# Altium schematic sheet JTAG.SchDoc: OnBoard Debugger
size A4; ApprovedBy: Diogo Gomes; CheckedBy: Bruno, Candido, Pedro; Author: João Vieira; CompanyName: LART; DrawnBy: João Vieira; Organization: LART; Address1: Morro do Lena; Address2: Alto Do Vieiro; Address3: APT 4163, Building D; DocumentNumber: 1; Revision: v1.4.2; SheetNumber: 2; SheetTotal: 12; ENG_APP_DATE: --/--/--; DSN_APP_DATE: --/--/--; CHK_APP_DATE: --/--/--; ProjectTitle: Autonomous Control Unit; Summary: The Debugger Interface as a alternative to using an offboard programmer; CheckedBy1: G. Candido; CheckedBy2: F. Chen; CheckedBy3: P. Ferreira; CheckedBy4: B. Vicente; CheckedBy5: _; CheckedBy6: _; CheckedBy7: _; version_tag: 1.4.2; ImagePath: C:\Users\micron\Desktop
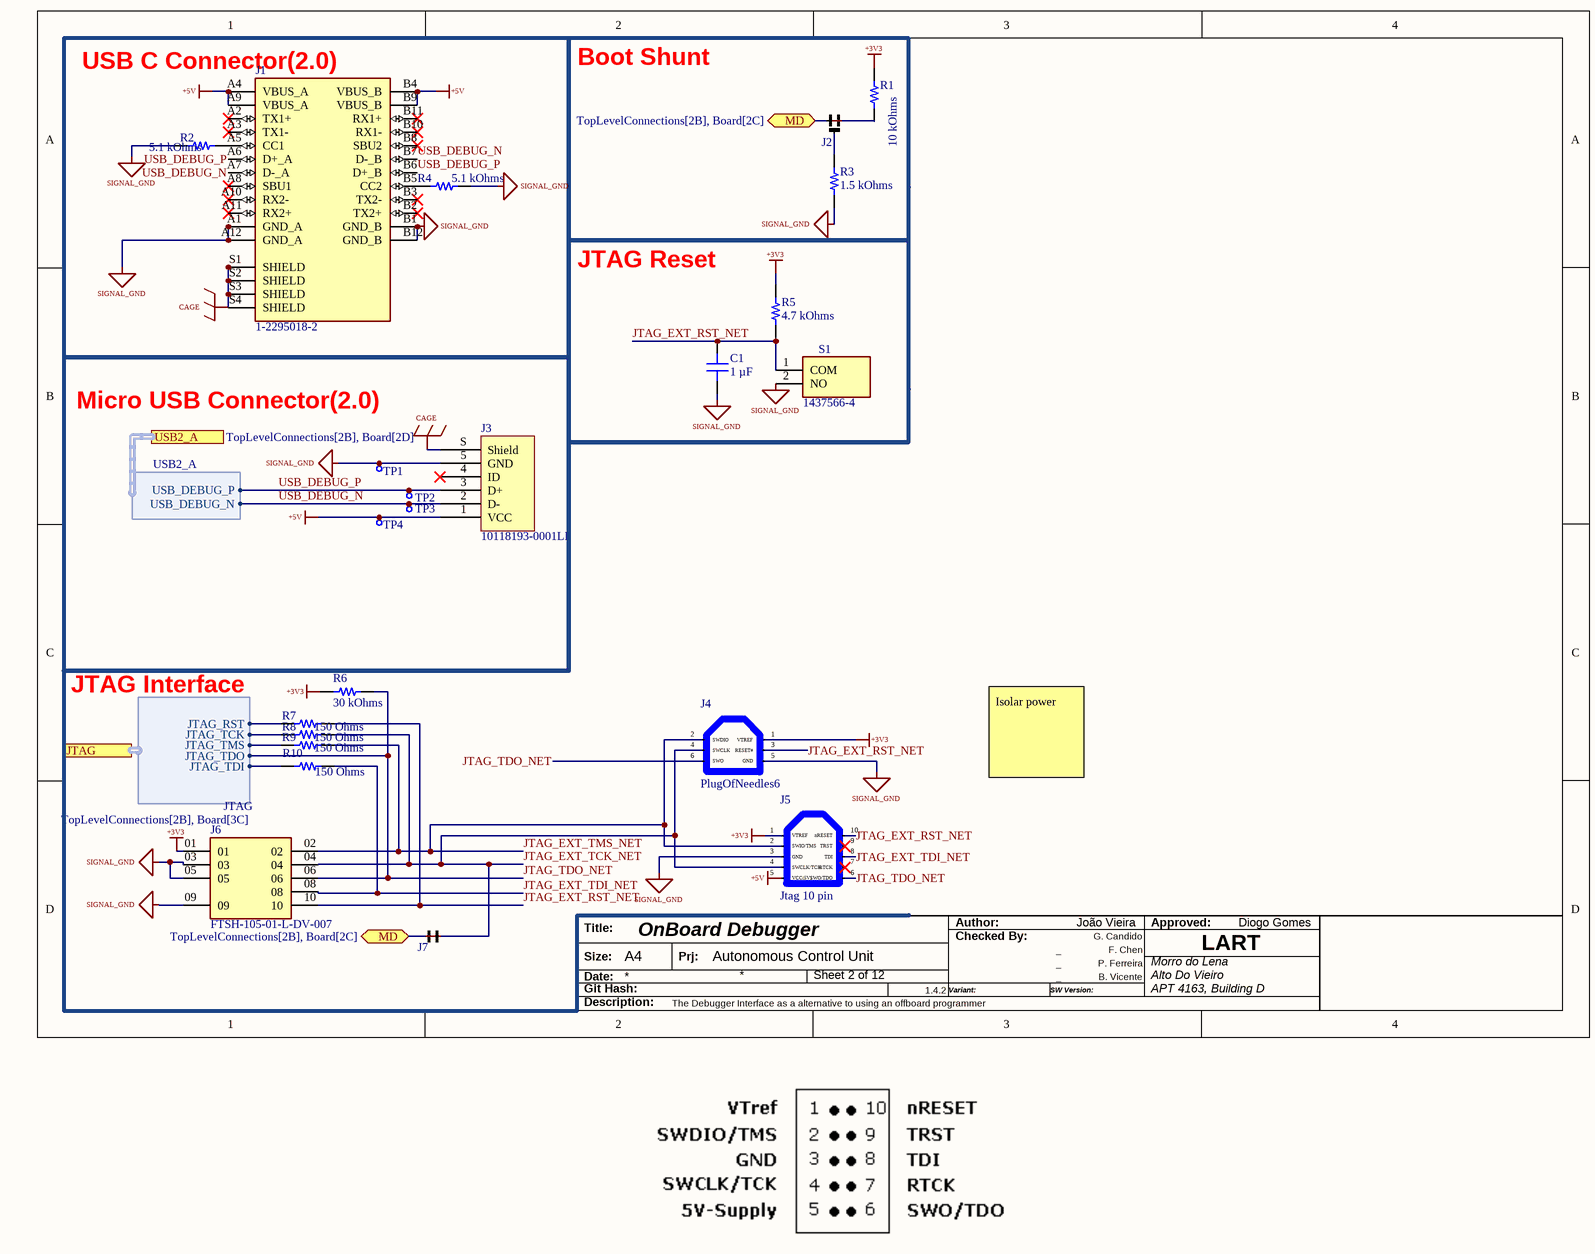
[diagram p0: JTAG.SchDoc]

## Parts
C1  value 1 µF  [CAP 0805_2012]  (hidden comment: 1uF)
J1  1-2295018-2  [TE_1-2295018-2]
J2  A solder Bridge  [Solder Bridge 805 switch]  (value not drawn)
J3  10118193-0001LF  [FCI USB 10118193-0001LF]
J4  PlugOfNeedles6  [Pluck-Of-Needles 6 POS naked]
J5  Jtag 10 pin  [Pluck-Of-Needles 10 POS]
J6  FTSH-105-01-L-DV-007  [SAMTEC_FTSH-105-01-L-DV-007]
J7  A solder Bridge  [Solder Bridge 805]  (value not drawn)
R1  value 10 kOhms  [RES 0805_2012]  (hidden comment: 10k)
R2  5.1 kOhms  [RES 0805_2012]
R3  value 1.5 kOhms  [RES 0805_2012]  (hidden comment: 1.5k)
R4  5.1 kOhms  [RES 0805_2012]
R5  value 4.7 kOhms  [RES 0805_2012]  (hidden comment: 4.7k)
R6  value 30 kOhms  [RES 0805_2012]  (hidden comment: 30k)
R7  value 150 Ohms  [RES 0805_2012]  (hidden comment: 150)
R8  value 150 Ohms  [RES 0805_2012]  (hidden comment: 150)
R9  value 150 Ohms  [RES 0805_2012]  (hidden comment: 150)
R10  value 150 Ohms  [RES 0805_2012]  (hidden comment: 150)
S1  1437566-4  [14375664]
TP1  TestPad  [Test Pad Small]  (value not drawn)
TP2  TestPad  [Test Pad Miniscule]  (value not drawn)
TP3  TestPad  [Test Pad Miniscule]  (value not drawn)
TP4  TestPad  [Test Pad Small]  (value not drawn)

## Blocks framed on the sheet
Boot Shunt: J2 R1 R3
JTAG Reset: C1 R5 S1

## Ports
JTAG (harness JTAG, see TopLevelConnections[2B], Board[3C]), MD (bidir, see TopLevelConnections[2B], Board[2C]), USB2_A (harness USB2_A, see TopLevelConnections[2B], Board[2D])

## Harnesses
JTAG: JTAG_RST, JTAG_TCK, JTAG_TMS, JTAG_TDO, JTAG_TDI
USB2_A: USB_DEBUG_N, USB_DEBUG_P

## Nets
+3V3: J4.1(VTREF) J5.1(VTREF) J6.01 R1.2 R5.2 R6.2
+5V: J1.A4(VBUS_A) J1.A9(VBUS_A) J1.B4(VBUS_B) J1.B9(VBUS_B) J3.1(VCC) J5.5(VCC(5V)) TP4.P2
CAGE: J1.S1(SHIELD) J1.S2(SHIELD) J1.S3(SHIELD) J1.S4(SHIELD) J3.S(Shield)
SIGNAL_GND: C1.1 J1.A1(GND_A) J1.A12(GND_A) J1.B1(GND_B) J1.B12(GND_B) J3.5(GND) J4.5(GND) J5.3(GND) J6.03 J6.05 J6.09 R2.1 R3.1 R4.2 S1.2(NO) TP1.P2
JTAG_EXT_RST_NET: C1.2 J4.3(RESET#) J5.10(nRESET) J6.10 R5.1 R7.2 S1.1(COM)
JTAG_EXT_TCK_NET: J4.4(SWCLK) J5.4(SWCLK/TCK) J6.04 J7.P1 R8.2
JTAG_EXT_TDI_NET: J5.8(TDI) J6.08 R10.2
JTAG_EXT_TMS_NET: J4.2(SWDIO) J5.2(SWIO/TMS) J6.02 R9.2
JTAG_TDO_NET: J4.6(SWO) J5.6(SWO/TDO) J6.06 R6.1 ; port JTAG.JTAG_TDO
MD: J2.P1 J7.P0 ; port MD
USB_DEBUG_N: J1.A7(D-_A) J1.B7(D-_B) J3.2(D-) TP3.P2 ; port USB2_A.USB_DEBUG_N
USB_DEBUG_P: J1.A6(D+_A) J1.B6(D+_B) J3.3(D+) TP2.P2 ; port USB2_A.USB_DEBUG_P
NetJ1_A5: J1.A5(CC1) R2.2
NetJ1_B5: J1.B5(CC2) R4.1
NetJ2_P0: J2.P0 R1.1
NetJ2_P2: J2.P2 R3.2
NetR7_1: R7.1 ; port JTAG.JTAG_RST
NetR8_1: R8.1 ; port JTAG.JTAG_TCK
NetR9_1: R9.1 ; port JTAG.JTAG_TMS
NetR10_1: R10.1 ; port JTAG.JTAG_TDI

Not connected (* = marked no-connect by the designer): J1 A2(TX1+)* A3(TX1-)* A8(SBU1)* A10(RX2-)* A11(RX2+)* B2(TX2+)* B3(TX2-)* B8(SBU2)* B10(RX1-)* B11(RX1+)*; J3 4(ID)*; J5 7(RTCK)* 9(TRST)*

## Notes on the sheet
- (near J1) USB C Connector(2.0)
- Micro USB Connector(2.0)
- JTAG Interface
- Isolar power
- Title:
- Author:
- Checked By:
- Approved:
- Size:
- Date:
- Git Hash:
- A4
- Prj:
- Variant:
- SW Version:
- Description:

## Library data of the parts
C1 = 0805B105K160CT: CAP CER 1UF 16V X7R 0805; manufacturer: Walsin Technology Corporation; Tolerance: ±10%; Part Number: 0805B105K160CT; Applications: General Purpose; Capacitance: 1 µF; componentlink1description: Datasheet; componentlink1url: https://www.passivecomponent.com/wp-content/uploads/datasheet/WTC_MLCC_General_Purpose.pdf; componentlink2description: DigiKey Link; componentlink2url: https://www.digikey.com/en/products/detail/walsin-technology-corporation/0805B105K160CT/6707557; Device Package: 0805 (2012 Metric); lastupdated: 09/02/2024 20:15:01; Lifecycle Status: Active; Minimum Order: 1; Mounting Type: Surface Mount, MLCC; Operating Temperature: -55°C ~ 125°C; Package / Case: 0805 (2012 Metric); packaging: TapeAndReel; partid: 39843; Part Status: Active; price: 0.01; series: -; Size / Dimension: 0.079" L x 0.049" W (2.00mm x 1.25mm); Supplier 1: DigiKey; Supplier Part Number 1: 1292-0805B105K160CT-ND; Temperature Coefficient: X7R; Thickness (Max): 0.053" (1.35mm); Voltage - Rated: 16V
J1 = 1-2295018-2: USB-C (USB TYPE-C) USB 3.2 Gen 2 (USB 3.1 Gen 2, Superspeed + (USB 3.1)) Receptacle Connector 24 Position Board Cutout, Surface Mount, Right Angle; Through Hole; MF: TE Connectivity AMP Connectors; Price: None; MP: 1-2295018-2; Package: None; Value: *; Purchase-URL: https://pricing.snapeda.com/search/part/1-2295018-2/?ref=eda; Availability: In Stock; SnapEDA_Link: https://www.snapeda.com/parts/1-2295018-2/TE+Connectivity/view-part/?ref=snap; Check_prices: https://www.snapeda.com/parts/1-2295018-2/TE+Connectivity/view-part/?ref=eda
J2 = Solder Bridge 805 Switch
J3 = 10118193-0001LF: CONN RCPT USB2.0 MICRO B SMD R/A; Manufacturer: Amphenol ICC (FCI); Connector Type: USB - micro B; Current Rating (Amps): 1.8A per Contact; Gender: Receptacle; Mating Cycles: 10000; Number of Contacts: 5; Number of Ports: 1; Shielding: Shielded; Voltage - Rated: 100VAC; Part Number: 10118193-0001LF; ComponentLink1Description: Datasheet; ComponentLink1URL: https://cdn.amphenol-icc.com/media/wysiwyg/files/documentation/datasheet/inputoutput/io_usb_micro.pdf; ComponentLink2Description: DigiKey Link; ComponentLink2URL: //digikey.com/product-detail/en/amphenol-icc-fci/10118193-0001LF/609-4616-2-ND/2785388; Features: Solder Retention; LastUpdated: 09/12/2019 20:51:28; Lifecycle Status: 0; Minimum Order: 1; Mounting Feature: Horizontal; Mounting Type: Surface Mount, Right Angle; Through Hole; Operating Temperature: -30°C ~ 80°C; Packaging: TapeAndReel; Part Status: Active; Price: 0.21; Series: -; Specifications: USB 2.0; Supplier 1: DigiKey; Supplier Part Number 1: 609-4616-2-ND; Termination: Solder
J5 = PlugOfNeedles10: A short footprint for jtag
J6 = FTSH-105-01-L-DV-007: Connector Header Surface Mount 10 position 0.050 (1.27mm); MP: FTSH-105-01-L-DV-007-K; MF: Samtec; Package: None; Purchase-URL: https://pricing.snapeda.com/search/part/FTSH-105-01-L-DV-007-K/?ref=eda; Digi-Key_Part_Number: SAM13932TR-ND; Check_prices: https://www.snapeda.com/parts/FTSH-105-01-L-DV-007-K/Samtec%20Inc./view-part/448626/?ref=eda; Value: *; SnapEDA_Link: https://www.snapeda.com/parts/FTSH-105-01-L-DV-007-K/Samtec%20Inc./view-part/448626/?ref=snap
J7 = Solder Bridge 805
R1 = RNCS0805BKE10K0: RES 10K OHM 0.1% 1/10W 0805; Manufacturer: Stackpole Electronics Inc; Power (Watts): 0.1W, 1/10W; Temperature Coefficient: ±25ppm/°C; Part Number: RNCS0805BKE10K0; ComponentLink1Description: Datasheet; ComponentLink1URL: https://www.seielect.com/catalog/sei-rncs_rnch.pdf; ComponentLink2Description: DigiKey Link; ComponentLink2URL: https://www.digikey.com/en/products/detail/stackpole-electronics-inc/RNCS0805BKE10K0/1800067; Composition: Thin Film; Device Package: 0805 (2012 Metric); Features: Anti-Corrosive, Automotive AEC-Q200, Moisture Resistant; Height - Seated (Max): 0.026" (0.65mm); LastUpdated: 08/02/2024 21:02:39; Lifecycle Status: Active; Minimum Order: 1; Number of Terminations: 2; Operating Temperature: -55°C ~ 155°C; Package / Case: 0805 (2012 Metric); Packaging: TapeAndReel; PartId: 27713; Part Status: Active; Price: 0.07; Ratings: AEC-Q200; Resistance: 10 kOhms; Series: RNCS; Size / Dimension: 0.079" L x 0.049" W (2.00mm x 1.25mm); Supplier 1: DigiKey; Supplier Part Number 1: RNCS0805BKE10K0CT-ND; Supplier Device Package: 0805; Tolerance: ±0.1%
R2 R4 = ERA-6AED512V: RES SMD 5.1K OHM 0.5% 1/8W 0805; Manufacturer: Panasonic Electronic Components; Power (Watts): 0.125W, 1/8W; Temperature Coefficient: ±25ppm/°C; Part Number: ERA-6AED512V; Value: 5.1 kOhms; ComponentLink1Description: Datasheet; ComponentLink1URL: https://industrial.panasonic.com/cdbs/www-data/pdf/RDM0000/AOA0000C307.pdf; ComponentLink2Description: DigiKey Link; ComponentLink2URL: https://www.digikey.com/en/products/detail/panasonic-electronic-components/ERA-6AED512V/9373625; Composition: Thin Film; Device Package: 0805 (2012 Metric); Features: Automotive AEC-Q200; Height - Seated (Max): 0.024" (0.60mm); LastUpdated: 02/02/2024 21:00:47; Lifecycle Status: Active; Minimum Order: 1; Number of Terminations: 2; Operating Temperature: -55°C ~ 155°C; Package / Case: 0805 (2012 Metric); Packaging: TapeAndReel; PartId: 27812; Part Status: Active; Price: 0.04; Ratings: AEC-Q200; Resistance: 5.1 kOhms; Series: ERA-6A; Size / Dimension: 0.079" L x 0.049" W (2.00mm x 1.25mm); Supplier 1: DigiKey; Supplier Part Number 1: P123856CT-ND; Supplier Device Package: 0805; Tolerance: ±0.5%
R3 = RNCF0805DTE1K50: RES 1.5K OHM 0.5% 1/8W 0805; Manufacturer: Stackpole Electronics Inc; Power (Watts): 0.125W, 1/8W; Temperature Coefficient: ±25ppm/°C; Part Number: RNCF0805DTE1K50; ComponentLink1Description: Datasheet; ComponentLink1URL: https://www.seielect.com/catalog/sei-rncf.pdf; ComponentLink2Description: DigiKey Link; ComponentLink2URL: https://www.digikey.com/en/products/detail/stackpole-electronics-inc/RNCF0805DTE1K50/1708177; Composition: Thin Film; Device Package: 0805 (2012 Metric); Features: Automotive AEC-Q200; Height - Seated (Max): 0.026" (0.65mm); LastUpdated: 08/02/2024 21:02:37; Lifecycle Status: Active; Minimum Order: 1; Number of Terminations: 2; Operating Temperature: -55°C ~ 155°C; Package / Case: 0805 (2012 Metric); Packaging: TapeAndReel; PartId: 28003; Part Status: Active; Price: 0.01; Ratings: AEC-Q200; Resistance: 1.5 kOhms; Series: RNCF; Size / Dimension: 0.079" L x 0.049" W (2.00mm x 1.25mm); Supplier 1: DigiKey; Supplier Part Number 1: RNCF0805DTE1K50CT-ND; Supplier Device Package: 0805; Tolerance: ±0.5%
R5 = RCS08054K70JNEA: RES SMD 4.7K OHM 5% 1/2W 0805; Manufacturer: Vishay Dale; Power (Watts): 0.5W, 1/2W; Temperature Coefficient: ±200ppm/°C; Part Number: RCS08054K70JNEA; ComponentLink1Description: Datasheet; ComponentLink1URL: http://www.vishay.com/docs/20065/rcse3.pdf; ComponentLink2Description: DigiKey Link; ComponentLink2URL: https://www.digikey.com/en/products/detail/vishay-dale/RCS08054K70JNEA/5867012; Composition: Thick Film; Device Package: 0805 (2012 Metric); Features: Automotive AEC-Q200, Pulse Withstanding; Height - Seated (Max): 0.020" (0.50mm); LastUpdated: 08/02/2024 21:02:38; Lifecycle Status: Active; Minimum Order: 1; Number of Terminations: 2; Operating Temperature: -55°C ~ 155°C; Package / Case: 0805 (2012 Metric); Packaging: TapeAndReel; PartId: 27839; Part Status: Active; Price: 0.02; Ratings: AEC-Q200; Resistance: 4.7 kOhms; Series: RCS e3; Size / Dimension: 0.079" L x 0.049" W (2.00mm x 1.25mm); Supplier 1: DigiKey; Supplier Part Number 1: 541-2866-1-ND; Supplier Device Package: 0805; Tolerance: ±5%
R6 = 3430A2F30KTDF: 3430 A2 1% 30K 100PPM 1K RL; Manufacturer: TE Connectivity Passive Product; Power (Watts): 1W; Temperature Coefficient: ±100ppm/°C; Part Number: 3430A2F30KTDF; ComponentLink2Description: DigiKey Link; ComponentLink2URL: https://www.digikey.com/en/products/detail/te-connectivity-passive-product/3430A2F30KTDF/17763964; Composition: Thick Film; Device Package: 0805 (2012 Metric); Features: Automotive AEC-Q200; Height - Seated (Max): 0.026" (0.65mm); LastUpdated: 04/02/2024 21:02:40; Lifecycle Status: Active; Minimum Order: 1; Number of Terminations: 2; Operating Temperature: -55°C ~ 155°C; Package / Case: 0805 (2012 Metric); Packaging: TapeAndReel; PartId: 76016; Part Status: Active; Price: 0.02; Ratings: AEC-Q200; Resistance: 30 kOhms; Series: 3430; Size / Dimension: 0.049" L x 0.079" W (1.25mm x 2.00mm); Supplier 1: DigiKey; Supplier Part Number 1: 1712-3430A2F30KTDFCT-ND; Supplier Device Package: 0508; Tolerance: ±1%
R7-R10 = 4-2176091-1: RES SMD 150 OHM 0.1% 1/4W 0805; Manufacturer: TE Connectivity Passive Product; Power (Watts): 0.25W, 1/4W; Temperature Coefficient: ±25ppm/°C; Part Number: 4-2176091-1; ComponentLink1Description: Datasheet; ComponentLink1URL: https://www.te.com/commerce/DocumentDelivery/DDEController?Action=srchrtrv&DocNm=1773272&DocType=DS&DocLang=English; ComponentLink2Description: DigiKey Link; ComponentLink2URL: https://www.digikey.com/en/products/detail/te-connectivity-passive-product/4-2176091-1/4033932; Composition: Thin Film; Device Package: 0805 (2012 Metric); Height - Seated (Max): 0.026" (0.65mm); LastUpdated: 04/02/2024 21:05:09; Lifecycle Status: Active; Minimum Order: 1; Number of Terminations: 2; Operating Temperature: -55°C ~ 155°C; Package / Case: 0805 (2012 Metric); Packaging: TapeAndReel; PartId: 28504; Part Status: Active; Price: 0.14; Resistance: 150 Ohms; Series: RP73P, Holsworthy; Size / Dimension: 0.079" L x 0.049" W (2.00mm x 1.25mm); Supplier 1: DigiKey; Supplier Part Number 1: A110464CT-ND; Supplier Device Package: 0805; Tolerance: ±0.1%
S1 = 1437566-4: Switch; Manufacturer_Name: TE Connectivity; Datasheet Link: https://www.te.com/commerce/DocumentDelivery/DDEController?Action=showdoc&DocId=Customer+Drawing%7F1437566-3%7FC2%7Fpdf%7FEnglish%7FENG_CD_1437566-3_C7F14375662_1437566_3_1_c.dwg.pdf%-4; Height: 4.87mm; Manufacturer_Part_Number: 1437566-4; Mouser Part Number: N/A; Mouser Price/Stock: https://www.mouser.co.uk/ProductDetail/TE-Connectivity-Alcoswitch/1437566-4?qs=xoXDFGdkQ2nbcMrTmW1sHA%3D%3D; Arrow Part Number: 1437566-4; Arrow Price/Stock: https://www.arrow.com/en/products/1437566-4/te-connectivity?region=europe